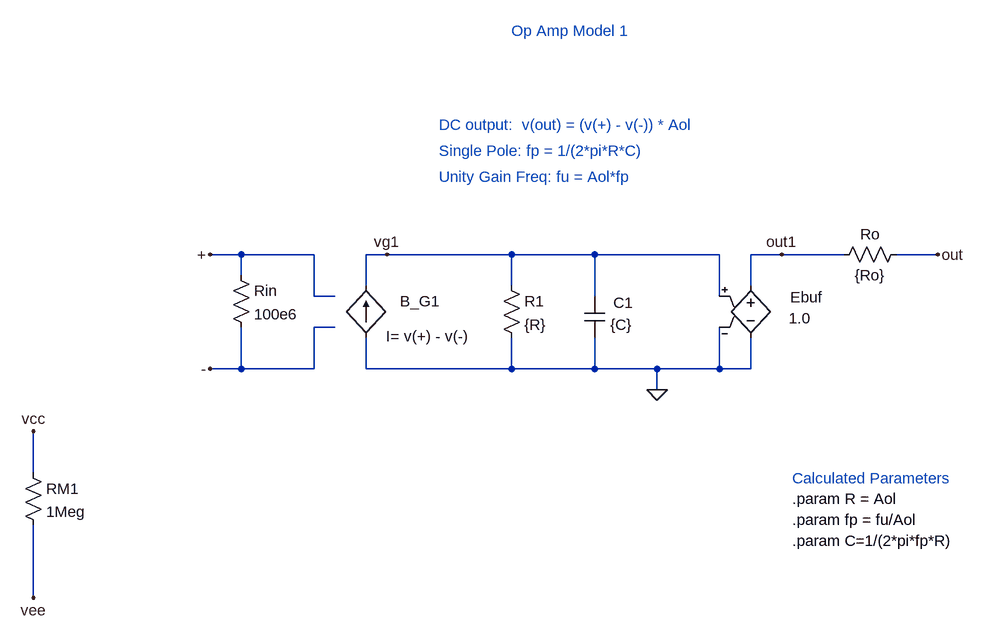
[diagram p0: schematic OPAMP_1.asc]
OPAMP_1.asc, the LTspice schematic file:
Version 4
SHEET 1 2028 888
WIRE -432 48 -480 48
WIRE -320 48 -432 48
WIRE -208 48 -240 48
WIRE -16 48 -208 48
WIRE 112 48 -16 48
WIRE 304 48 112 48
WIRE 400 48 352 48
WIRE 496 48 400 48
WIRE 640 48 576 48
WIRE -432 80 -432 48
WIRE -240 96 -240 48
WIRE -16 96 -16 48
WIRE 352 96 352 48
WIRE -320 112 -320 48
WIRE -288 112 -320 112
WIRE 112 112 112 48
WIRE 304 112 304 48
WIRE -288 160 -320 160
WIRE -432 224 -432 160
WIRE -432 224 -480 224
WIRE -320 224 -320 160
WIRE -320 224 -432 224
WIRE -240 224 -240 176
WIRE -16 224 -16 176
WIRE -16 224 -240 224
WIRE 112 224 112 176
WIRE 112 224 -16 224
WIRE 208 224 112 224
WIRE 304 224 304 160
WIRE 304 224 208 224
WIRE 352 224 352 176
WIRE 352 224 304 224
WIRE 208 256 208 224
WIRE -752 384 -752 320
WIRE -752 576 -752 464
FLAG -752 576 vee
FLAG -752 320 vcc
FLAG 400 48 out1
FLAG 640 48 out
FLAG -480 48 +
FLAG -480 224 -
FLAG -208 48 vg1
FLAG 208 256 0
SYMBOL e 352 80 R0
WINDOW 0 61 34 Left 2
WINDOW 3 59 66 Left 2
SYMATTR InstName Ebuf
SYMATTR Value 1.0
SYMBOL res 592 32 R90
WINDOW 0 0 56 VBottom 2
WINDOW 3 32 56 VTop 2
SYMATTR InstName Ro
SYMATTR Value {Ro}
SYMBOL res -32 80 R0
SYMATTR InstName R1
SYMATTR Value {R}
SYMBOL cap 96 112 R0
WINDOW 3 40 44 Left 2
WINDOW 0 45 10 Left 2
SYMATTR Value {C}
SYMATTR InstName C1
SYMBOL res -448 64 R0
SYMATTR InstName Rin
SYMATTR Value 100e6
SYMBOL res -768 368 R0
SYMATTR InstName RM1
SYMATTR Value 1Meg
SYMBOL bi2 -240 96 R0
WINDOW 3 31 78 Left 2
WINDOW 0 52 24 Left 2
SYMATTR Value I= v(+) - v(-)
SYMATTR InstName B_G1
TEXT 416 392 Left 2 ;Calculated Parameters
TEXT -16 -296 Left 2 ;Op Amp Model 1
TEXT 416 456 Left 2 !.param fp = fu/Aol
TEXT 416 488 Left 2 !.param C=1/(2*pi*fp*R)
TEXT 416 424 Left 2 !.param R = Aol
TEXT -128 -152 Left 2 ;DC output:  v(out) = (v(+) - v(-)) * Aol
TEXT -128 -112 Left 2 ;Single Pole: fp = 1/(2*pi*R*C)
TEXT -128 -72 Left 2 ;Unity Gain Freq: fu = Aol*fp

The netlist it stands for:
* OPAMP_1.asc
Ebuf out1 0 vg1 0 1.0
Ro out out1 {Ro}
R1 vg1 0 {R}
C1 vg1 0 {C}
Rin + - 100e6
RM1 vcc vee 1Meg
B_G1 0 vg1 I= v(+) - v(-)
* Calculated Parameters
* Op Amp Model 1
.param fp = fu/Aol
.param C=1/(2*pi*fp*R)
.param R = Aol
* DC output:  v(out) = (v(+) - v(-)) * Aol
* Single Pole: fp = 1/(2*pi*R*C)
* Unity Gain Freq: fu = Aol*fp
.backanno
.end